# EAGLE design 4xjacks_breakout (EAGLE 7.5.0)
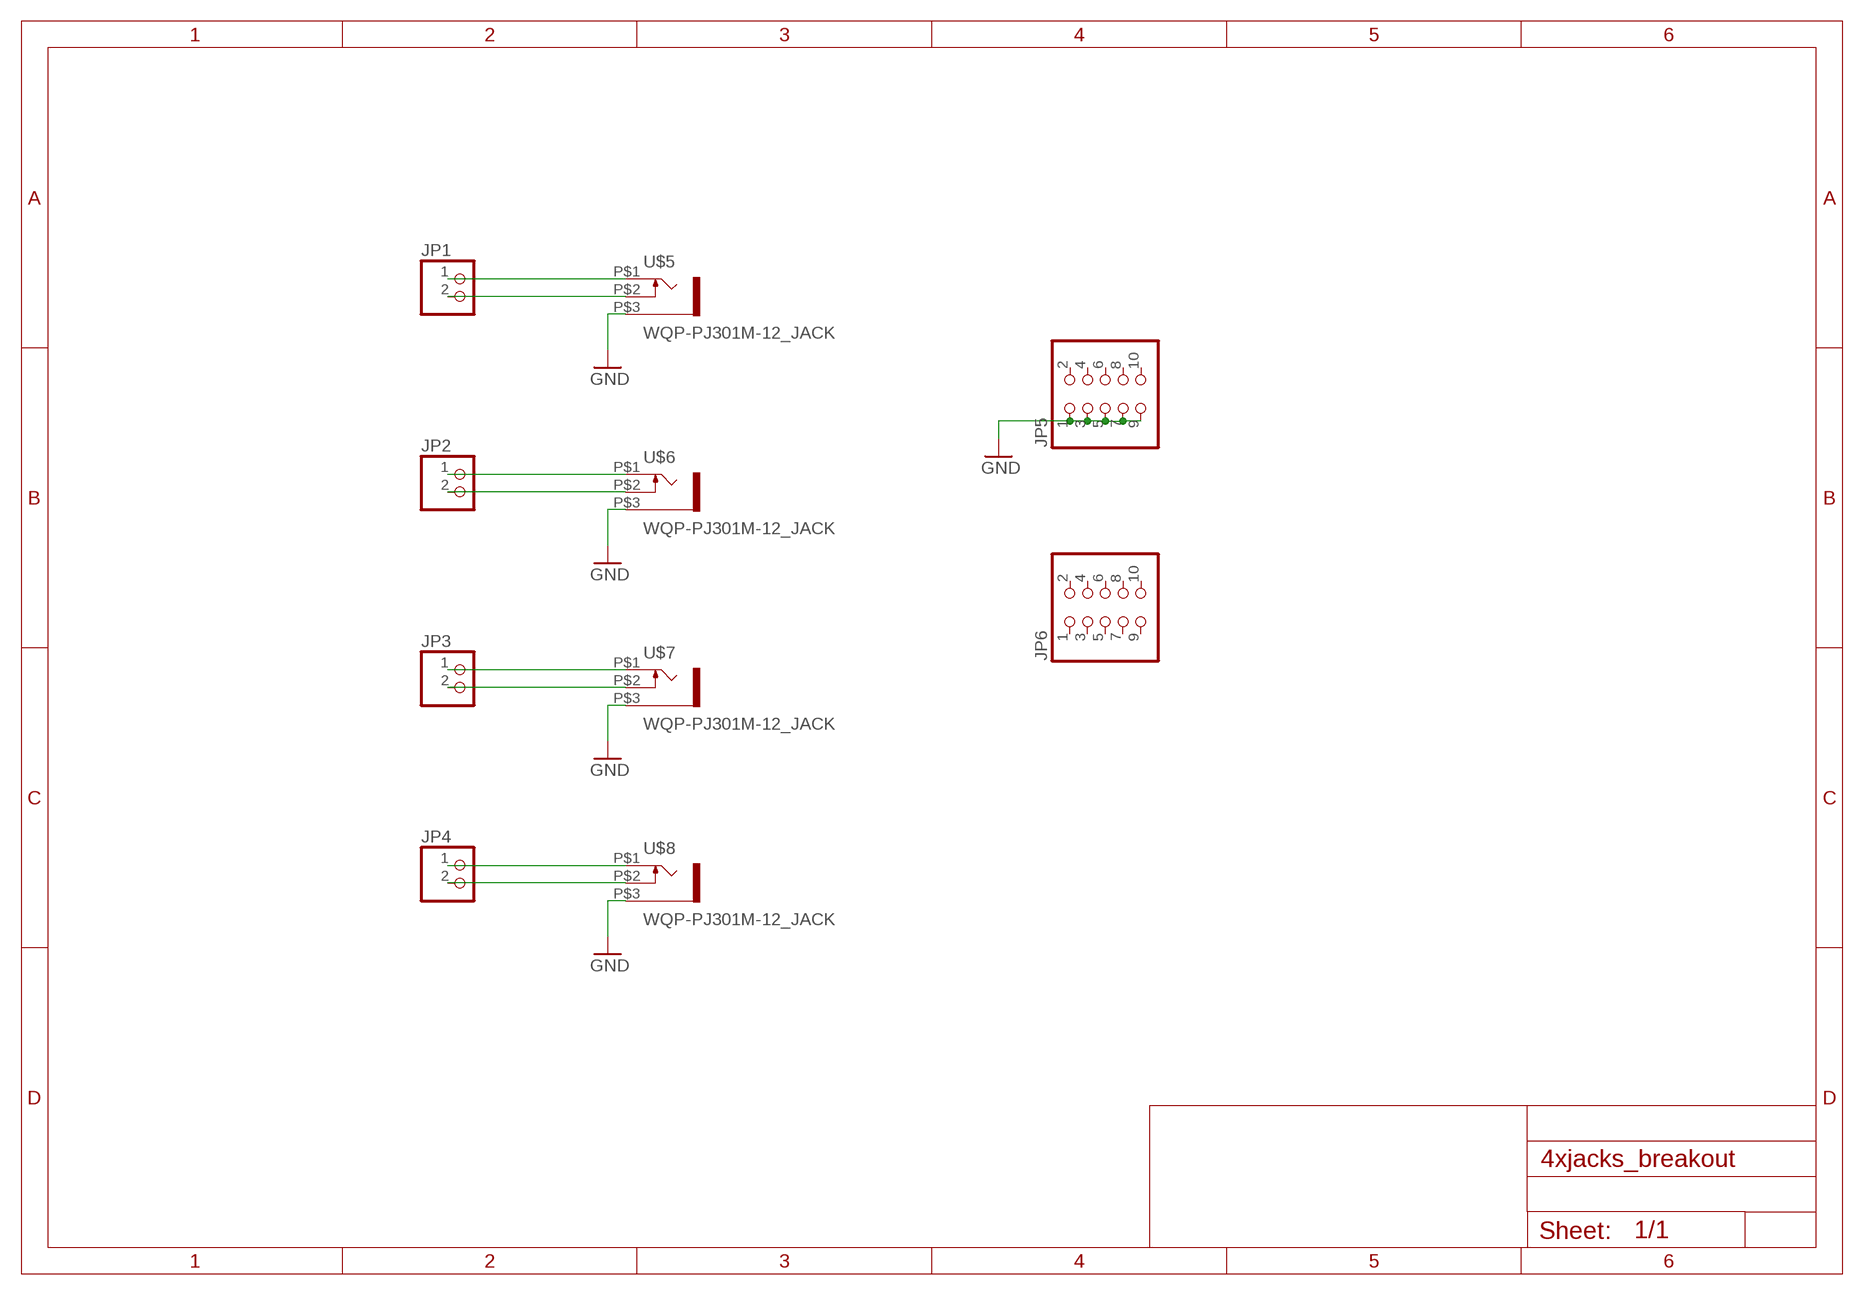
[diagram p0: schematic, sheet 1]

## Parts
JP1  PINHD-1X2  [1X02]
JP2  PINHD-1X2  [1X02]
JP3  PINHD-1X2  [1X02]
JP4  PINHD-1X2  [1X02]
JP5  PINHD-2X5  [2X05]
JP6  PINHD-2X5  [2X05]
U$5  WQP-PJ301M-12_JACK  [WQP-PJ301M-12_JACK]
U$6  WQP-PJ301M-12_JACK  [WQP-PJ301M-12_JACK]
U$7  WQP-PJ301M-12_JACK  [WQP-PJ301M-12_JACK]
U$8  WQP-PJ301M-12_JACK  [WQP-PJ301M-12_JACK]

## Nets
GND: JP5.1 JP5.3 JP5.5 JP5.7 JP5.9 U$5.P$3 U$6.P$3 U$7.P$3 U$8.P$3
N$1: JP1.1 U$5.P$1
N$2: JP1.2 U$5.P$2
N$3: JP2.1 U$6.P$1
N$4: JP2.2 U$6.P$2
N$5: JP3.1 U$7.P$1
N$6: JP3.2 U$7.P$2
N$7: JP4.1 U$8.P$1
N$8: JP4.2 U$8.P$2
Unconnected: JP5.2 JP5.4 JP5.6 JP5.8 JP5.10 JP6.1 JP6.2 JP6.3 JP6.4 JP6.5 JP6.6 JP6.7 JP6.8 JP6.9 JP6.10

## Library data of the parts
JP1-JP4 = pinhead:PINHD-1X2: PIN HEADER
JP5 JP6 = pinhead:PINHD-2X5: PIN HEADER
U$5-U$8 = thonkiconn:WQP-PJ301M-12_JACK

## Board
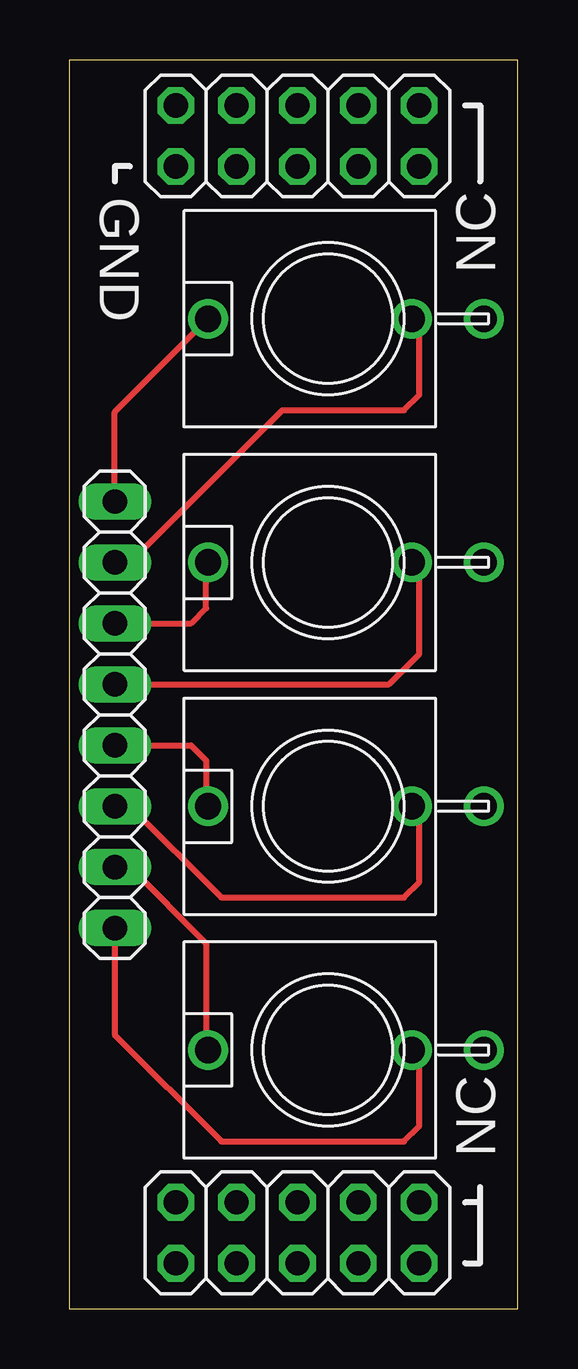
[diagram p1: board, top side]
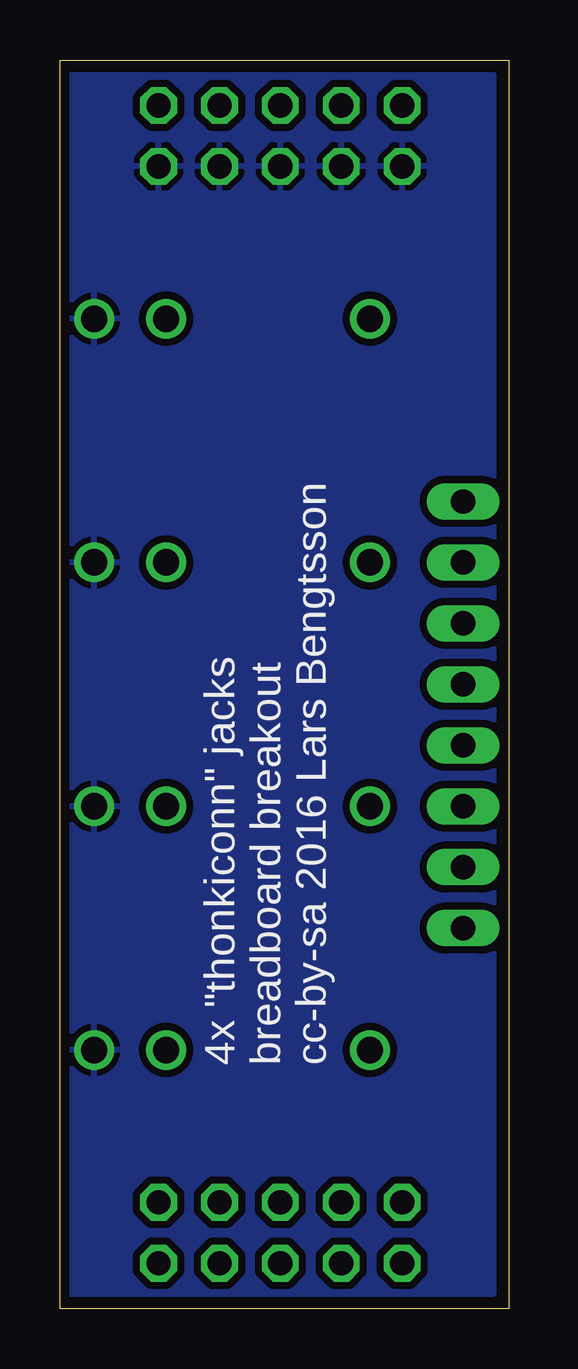
[diagram p2: board, bottom side, seen from below]

Size 18.72 x 52.06 mm. Coordinates in mm from the lower left corner, seen from the top.
Outline: 0,0 18.72,0 18.72,52.06 0,52.06 0,0
Copper layers (1*16): Top 0.0356mm / dielectric 1.5011mm / Bottom 0.0356mm
Design rules "LaenPCBOrder": minimum track width 6mil, minimum drill 13mil, track to track 6mil, track to pad 6mil, pad to pad 6mil, via to via 6mil, smd to smd 6mil, copper to edge 15mil, drill to drill 6mil, minimum pad ring 7mil, minimum via ring 7mil, stop-mask expansion 3mil, vias tented up to drill 0mil, thermal gap 10mil

### Footprints (pad centres in the part's own frame; a part is rotated, then mirrored left to right if it is on the bottom)
1X02 = drill 1.016 long: 1 -1.27,0; 2 1.27,0
2X05 = drill 1.016 octagon: 1 -5.08,-1.27; 2 -5.08,1.27; 3 -2.54,-1.27; 4 -2.54,1.27; 5 0,-1.27; 6 0,1.27; 7 2.54,-1.27; 8 2.54,1.27; 9 5.08,-1.27; 10 5.08,1.27
WQP-PJ301M-12_JACK = drill 1.1: P$1 0,5; P$2 0,-3.5; P$3 0,-6.5

### Placement (x,y rotation side)
JP1  1.91,32.39 270 top
JP2  1.91,27.3 270 top
JP3  1.91,22.22 270 top
JP4  1.91,17.14 270 top
JP5  9.53,48.9 0 top
JP6  9.53,3.17 0 top
U$5  10.79,41.27 90 top
U$6  10.79,31.11 90 top
U$7  10.79,20.95 90 top
U$8  10.79,10.79 90 top

### Tracks (layer width: path | path; a pad name or v marks a point on that pad's centre or on a via)
GND
  pour Bottom (isolate 0.305): 0.64,51.44 18.41,51.44 18.41,0.64 0.64,0.64
N$1
  Top 0.254: JP1.1 1.91,37.39 U$5.P$1
N$2
  Top 0.254: JP1.2 2.54,31.11 8.89,37.47 13.97,37.47 14.61,38.1 14.61,40.97 U$5.P$2
N$3
  Top 0.254: JP2.1 5.08,28.57 5.71,29.21 5.71,31.04 U$6.P$1
N$4
  Top 0.254: JP2.2 13.34,26.04 14.61,27.3 14.61,30.8 U$6.P$2
N$5
  Top 0.254: JP3.1 5.08,23.49 5.71,22.86 5.71,21.04 U$7.P$1
N$6
  Top 0.254: JP3.2 2.54,20.95 6.35,17.14 13.97,17.14 14.61,17.78 14.61,20.64 U$7.P$2
N$7
  Top 0.254: JP4.1 2.54,18.41 5.71,15.24 5.71,10.88 U$8.P$1
N$8
  Top 0.254: JP4.2 1.91,11.43 6.35,6.99 13.97,6.99 14.61,7.62 14.61,10.48 U$8.P$2

### Text on the board
tPlace: GND | NC | NC
bPlace: 4x "thonkiconn" jacks / breadboard breakout / cc-by-sa 2016 Lars Bengtsson